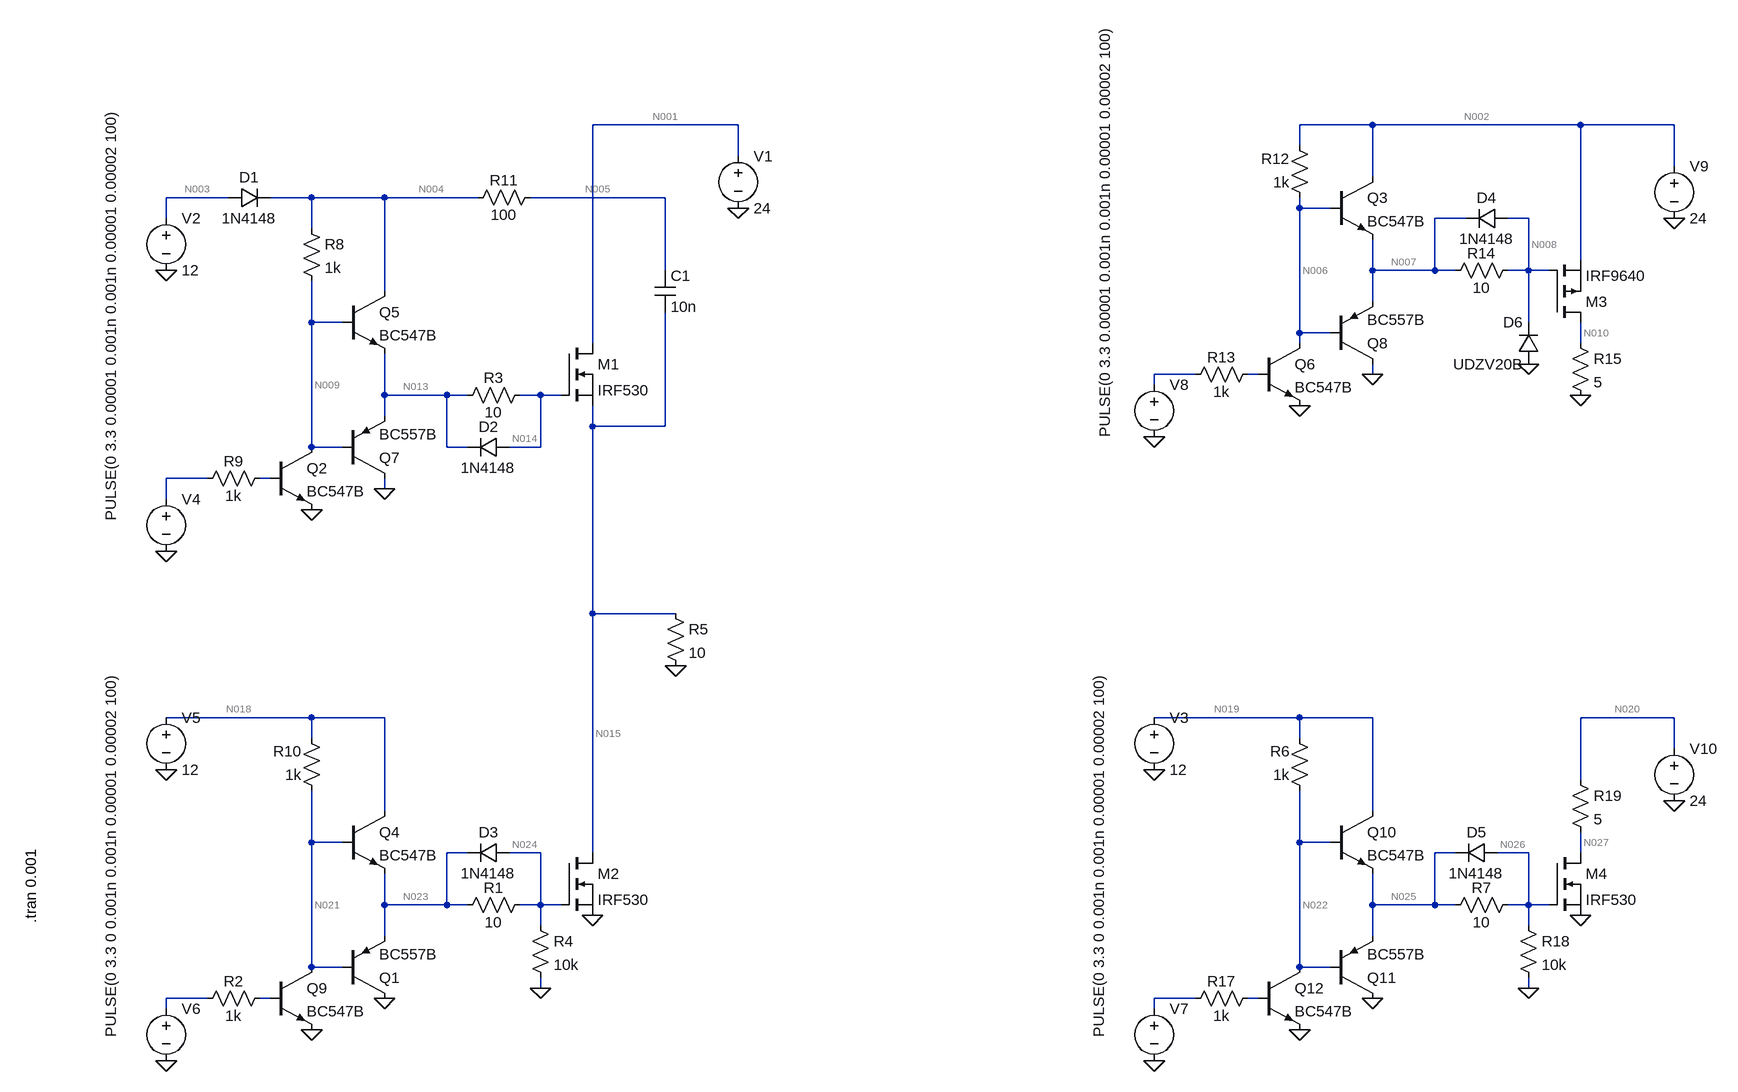
[diagram p0: schematic symulacja.asc]
symulacja.asc, the LTspice schematic file:
Version 4.1
SHEET 1 2692 1396
WIRE 960 -448 736 -448
WIRE 1936 -448 1824 -448
WIRE 2256 -448 1936 -448
WIRE 2400 -448 2256 -448
WIRE 1824 -416 1824 -448
WIRE 960 -400 960 -448
WIRE 2400 -384 2400 -448
WIRE 1936 -368 1936 -448
WIRE 176 -336 80 -336
WIRE 304 -336 240 -336
WIRE 416 -336 304 -336
WIRE 560 -336 416 -336
WIRE 848 -336 640 -336
WIRE 1824 -320 1824 -336
WIRE 1872 -320 1824 -320
WIRE 80 -304 80 -336
WIRE 2080 -304 2032 -304
WIRE 2176 -304 2144 -304
WIRE 304 -288 304 -336
WIRE 2256 -240 2256 -448
WIRE 848 -224 848 -336
WIRE 1936 -224 1936 -272
WIRE 2032 -224 2032 -304
WIRE 2032 -224 1936 -224
WIRE 2064 -224 2032 -224
WIRE 2176 -224 2176 -304
WIRE 2176 -224 2144 -224
WIRE 2208 -224 2176 -224
WIRE 416 -192 416 -336
WIRE 1936 -176 1936 -224
WIRE 304 -144 304 -208
WIRE 352 -144 304 -144
WIRE 2176 -144 2176 -224
WIRE 1824 -128 1824 -320
WIRE 1872 -128 1824 -128
WIRE 736 -112 736 -448
WIRE 1824 -112 1824 -128
WIRE 2256 -112 2256 -144
WIRE 1664 -64 1600 -64
WIRE 1760 -64 1744 -64
WIRE 1936 -64 1936 -80
WIRE 1600 -48 1600 -64
WIRE 416 -32 416 -96
WIRE 512 -32 416 -32
WIRE 544 -32 512 -32
WIRE 656 -32 624 -32
WIRE 688 -32 656 -32
WIRE 416 0 416 -32
WIRE 736 16 736 -16
WIRE 848 16 848 -160
WIRE 848 16 736 16
WIRE 304 48 304 -144
WIRE 352 48 304 48
WIRE 512 48 512 -32
WIRE 544 48 512 48
WIRE 656 48 656 -32
WIRE 656 48 608 48
WIRE 144 96 80 96
WIRE 240 96 224 96
WIRE 416 112 416 96
WIRE 80 128 80 96
WIRE 736 304 736 16
WIRE 864 304 736 304
WIRE 304 464 80 464
WIRE 416 464 304 464
WIRE 1824 464 1600 464
WIRE 1936 464 1824 464
WIRE 2400 464 2256 464
WIRE 304 496 304 464
WIRE 1824 496 1824 464
WIRE 2400 512 2400 464
WIRE 2256 560 2256 464
WIRE 416 608 416 464
WIRE 1936 608 1936 464
WIRE 304 656 304 576
WIRE 352 656 304 656
WIRE 1824 656 1824 576
WIRE 1872 656 1824 656
WIRE 544 672 512 672
WIRE 656 672 608 672
WIRE 736 672 736 304
WIRE 2064 672 2032 672
WIRE 2176 672 2128 672
WIRE 2256 672 2256 640
WIRE 416 752 416 704
WIRE 512 752 512 672
WIRE 512 752 416 752
WIRE 544 752 512 752
WIRE 656 752 656 672
WIRE 656 752 624 752
WIRE 688 752 656 752
WIRE 1936 752 1936 704
WIRE 2032 752 2032 672
WIRE 2032 752 1936 752
WIRE 2064 752 2032 752
WIRE 2176 752 2176 672
WIRE 2176 752 2144 752
WIRE 2208 752 2176 752
WIRE 656 784 656 752
WIRE 2176 784 2176 752
WIRE 416 800 416 752
WIRE 1936 800 1936 752
WIRE 304 848 304 656
WIRE 352 848 304 848
WIRE 1824 848 1824 656
WIRE 1872 848 1824 848
WIRE 656 880 656 864
WIRE 2176 880 2176 864
WIRE 144 896 80 896
WIRE 240 896 224 896
WIRE 1664 896 1600 896
WIRE 1760 896 1744 896
WIRE 80 912 80 896
WIRE 1600 912 1600 896
FLAG 736 768 0
FLAG 80 544 0
FLAG 80 992 0
FLAG 416 896 0
FLAG 304 944 0
FLAG 656 880 0
FLAG 960 -320 0
FLAG 80 208 0
FLAG 80 -224 0
FLAG 304 144 0
FLAG 416 112 0
FLAG 1600 32 0
FLAG 1936 -64 0
FLAG 1824 -16 0
FLAG 2400 -304 0
FLAG 864 384 0
FLAG 2256 768 0
FLAG 1600 544 0
FLAG 1600 992 0
FLAG 1936 896 0
FLAG 1824 944 0
FLAG 2176 880 0
FLAG 2256 -32 0
FLAG 2400 592 0
FLAG 2176 -80 0
SYMBOL npn 352 608 R0
SYMATTR InstName Q4
SYMATTR Value BC547B
SYMBOL nmos 688 672 R0
SYMATTR InstName M2
SYMATTR Value IRF530
SYMBOL res 320 592 R180
WINDOW 0 31 76 Left 2
WINDOW 3 31 40 Left 2
SYMATTR InstName R10
SYMATTR Value 1k
SYMBOL voltage 80 448 R0
WINDOW 123 0 0 Left 0
WINDOW 39 0 0 Left 0
SYMATTR InstName V5
SYMATTR Value 12
SYMBOL voltage 80 896 R0
WINDOW 3 -85 -507 VRight 2
WINDOW 123 0 0 Left 0
WINDOW 39 0 0 Left 0
SYMATTR Value PULSE(0 3.3 0 0.001n 0.001n 0.00001 0.00002 100)
SYMATTR InstName V6
SYMBOL pnp 352 896 M180
SYMATTR InstName Q1
SYMATTR Value BC557B
SYMBOL res 640 736 R90
WINDOW 0 5 56 VBottom 2
WINDOW 3 27 56 VTop 2
SYMATTR InstName R1
SYMATTR Value 10
SYMBOL res 240 880 R90
WINDOW 0 5 56 VBottom 2
WINDOW 3 27 56 VTop 2
SYMATTR InstName R2
SYMATTR Value 1k
SYMBOL res 640 768 R0
SYMATTR InstName R4
SYMATTR Value 10k
SYMBOL voltage 960 -416 R0
WINDOW 123 0 0 Left 0
WINDOW 39 0 0 Left 0
SYMATTR InstName V1
SYMATTR Value 24
SYMBOL voltage 80 112 R0
WINDOW 3 -85 -592 VRight 2
WINDOW 123 0 0 Left 0
WINDOW 39 0 0 Left 0
SYMATTR Value PULSE(0 3.3 0.00001 0.001n 0.001n 0.00001 0.00002 100)
SYMATTR InstName V4
SYMBOL nmos 688 -112 R0
SYMATTR InstName M1
SYMATTR Value IRF530
SYMBOL res 640 -48 R90
WINDOW 0 5 56 VBottom 2
WINDOW 3 27 56 VTop 2
SYMATTR InstName R3
SYMATTR Value 10
SYMBOL voltage 80 -320 R0
WINDOW 123 0 0 Left 0
WINDOW 39 0 0 Left 0
SYMATTR InstName V2
SYMATTR Value 12
SYMBOL diode 176 -320 R270
WINDOW 0 32 32 VTop 2
WINDOW 3 0 32 VBottom 2
SYMATTR InstName D1
SYMATTR Value 1N4148
SYMBOL res 288 -304 R0
SYMATTR InstName R8
SYMATTR Value 1k
SYMBOL cap 832 -224 R0
SYMATTR InstName C1
SYMATTR Value 10n
SYMBOL res 240 80 R90
WINDOW 0 5 56 VBottom 2
WINDOW 3 27 56 VTop 2
SYMATTR InstName R9
SYMATTR Value 1k
SYMBOL res 656 -352 R90
WINDOW 0 5 56 VBottom 2
WINDOW 3 27 56 VTop 2
SYMATTR InstName R11
SYMATTR Value 100
SYMBOL pmos 2208 -144 M180
SYMATTR InstName M3
SYMATTR Value IRF9640
SYMBOL res 1840 -320 R180
WINDOW 0 31 76 Left 2
WINDOW 3 31 40 Left 2
SYMATTR InstName R12
SYMATTR Value 1k
SYMBOL res 1760 -80 R90
WINDOW 0 5 56 VBottom 2
WINDOW 3 27 56 VTop 2
SYMATTR InstName R13
SYMATTR Value 1k
SYMBOL res 2160 -240 R90
WINDOW 0 5 56 VBottom 2
WINDOW 3 27 56 VTop 2
SYMATTR InstName R14
SYMATTR Value 10
SYMBOL voltage 1600 -64 R0
WINDOW 3 -76 -544 VRight 2
WINDOW 123 0 0 Left 0
WINDOW 39 0 0 Left 0
SYMATTR Value PULSE(0 3.3 0.00001 0.001n 0.001n 0.00001 0.00002 100)
SYMATTR InstName V8
SYMBOL voltage 2400 -400 R0
WINDOW 123 0 0 Left 0
WINDOW 39 0 0 Left 0
SYMATTR InstName V9
SYMATTR Value 24
SYMBOL npn 1872 -368 R0
SYMATTR InstName Q3
SYMATTR Value BC547B
SYMBOL npn 352 -192 R0
SYMATTR InstName Q5
SYMATTR Value BC547B
SYMBOL pnp 352 96 M180
SYMATTR InstName Q7
SYMATTR Value BC557B
SYMBOL pnp 1872 -80 M180
SYMATTR InstName Q8
SYMATTR Value BC557B
SYMBOL npn 240 48 R0
SYMATTR InstName Q2
SYMATTR Value BC547B
SYMBOL npn 1760 -112 R0
SYMATTR InstName Q6
SYMATTR Value BC547B
SYMBOL npn 240 848 R0
SYMATTR InstName Q9
SYMATTR Value BC547B
SYMBOL diode 608 32 R90
WINDOW 0 0 32 VBottom 2
WINDOW 3 32 32 VTop 2
SYMATTR InstName D2
SYMATTR Value 1N4148
SYMBOL diode 608 656 R90
WINDOW 0 0 32 VBottom 2
WINDOW 3 32 32 VTop 2
SYMATTR InstName D3
SYMATTR Value 1N4148
SYMBOL diode 2144 -320 R90
WINDOW 0 0 32 VBottom 2
WINDOW 3 32 32 VTop 2
SYMATTR InstName D4
SYMATTR Value 1N4148
SYMBOL res 848 288 R0
SYMATTR InstName R5
SYMATTR Value 10
SYMBOL npn 1872 608 R0
SYMATTR InstName Q10
SYMATTR Value BC547B
SYMBOL nmos 2208 672 R0
SYMATTR InstName M4
SYMATTR Value IRF530
SYMBOL res 1840 592 R180
WINDOW 0 31 76 Left 2
WINDOW 3 31 40 Left 2
SYMATTR InstName R6
SYMATTR Value 1k
SYMBOL voltage 1600 448 R0
WINDOW 123 0 0 Left 0
WINDOW 39 0 0 Left 0
SYMATTR InstName V3
SYMATTR Value 12
SYMBOL voltage 1600 896 R0
WINDOW 3 -85 -507 VRight 2
WINDOW 123 0 0 Left 0
WINDOW 39 0 0 Left 0
SYMATTR Value PULSE(0 3.3 0 0.001n 0.001n 0.00001 0.00002 100)
SYMATTR InstName V7
SYMBOL pnp 1872 896 M180
SYMATTR InstName Q11
SYMATTR Value BC557B
SYMBOL res 2160 736 R90
WINDOW 0 5 56 VBottom 2
WINDOW 3 27 56 VTop 2
SYMATTR InstName R7
SYMATTR Value 10
SYMBOL res 1760 880 R90
WINDOW 0 5 56 VBottom 2
WINDOW 3 27 56 VTop 2
SYMATTR InstName R17
SYMATTR Value 1k
SYMBOL res 2160 768 R0
SYMATTR InstName R18
SYMATTR Value 10k
SYMBOL npn 1760 848 R0
SYMATTR InstName Q12
SYMATTR Value BC547B
SYMBOL diode 2128 656 R90
WINDOW 0 0 32 VBottom 2
WINDOW 3 32 32 VTop 2
SYMATTR InstName D5
SYMATTR Value 1N4148
SYMBOL res 2240 -128 R0
SYMATTR InstName R15
SYMATTR Value 5
SYMBOL res 2240 544 R0
SYMATTR InstName R19
SYMATTR Value 5
SYMBOL voltage 2400 496 R0
WINDOW 123 0 0 Left 0
WINDOW 39 0 0 Left 0
SYMATTR InstName V10
SYMATTR Value 24
SYMBOL diode 2192 -80 R180
WINDOW 0 24 64 Left 2
WINDOW 3 24 0 Left 2
SYMATTR InstName D6
SYMATTR Value UDZV20B
TEXT -128 664 VRight 2 !.tran 0.001

The netlist it stands for:
* symulacja.asc
Q4 N018 N021 N023 0 BC547B
M2 N015 N024 0 0 IRF530
R10 N021 N018 1k
V5 N018 0 12
V6 N028 0 PULSE(0 3.3 0 0.001n 0.001n 0.00001 0.00002 100)
Q1 0 N021 N023 0 BC557B
R1 N024 N023 10
R2 N029 N028 1k
R4 N024 0 10k
V1 N001 0 24
V4 N016 0 PULSE(0 3.3 0.00001 0.001n 0.001n 0.00001 0.00002 100)
M1 N001 N014 N015 N015 IRF530
R3 N014 N013 10
V2 N003 0 12
D1 N003 N004 1N4148
R8 N004 N009 1k
C1 N005 N015 10n
R9 N017 N016 1k
R11 N005 N004 100
M3 N010 N008 N002 N002 IRF9640
R12 N006 N002 1k
R13 N012 N011 1k
R14 N008 N007 10
V8 N011 0 PULSE(0 3.3 0.00001 0.001n 0.001n 0.00001 0.00002 100)
V9 N002 0 24
Q3 N002 N006 N007 0 BC547B
Q5 N004 N009 N013 0 BC547B
Q7 0 N009 N013 0 BC557B
Q8 0 N006 N007 0 BC557B
Q2 N009 N017 0 0 BC547B
Q6 N006 N012 0 0 BC547B
Q9 N021 N029 0 0 BC547B
D2 N014 N013 1N4148
D3 N024 N023 1N4148
D4 N008 N007 1N4148
R5 N015 0 10
Q10 N019 N022 N025 0 BC547B
M4 N027 N026 0 0 IRF530
R6 N022 N019 1k
V3 N019 0 12
V7 N030 0 PULSE(0 3.3 0 0.001n 0.001n 0.00001 0.00002 100)
Q11 0 N022 N025 0 BC557B
R7 N026 N025 10
R17 N031 N030 1k
R18 N026 0 10k
Q12 N022 N031 0 0 BC547B
D5 N026 N025 1N4148
R15 N010 0 5
R19 N020 N027 5
V10 N020 0 24
D6 0 N008 UDZV20B
.model D D
.lib standard.dio
.model NPN NPN
.model PNP PNP
.lib standard.bjt
.model NMOS NMOS
.model PMOS PMOS
.lib standard.mos
.tran 0.001
.backanno
.end

* Results of the author's LTspice run, read from the files saved beside the schematic
* Operating Point, zero values left out:
*   V(n001) = 24 V
*   V(n002) = 24 V
*   V(n003) = 12 V
*   V(n004) = 12 V
*   V(n005) = 12 V
*   V(n006) = 22.71 V
*   V(n007) = 21.83 V
*   V(n008) = 20.15 V
*   V(n009) = 12 V
*   V(n010) = 2.11 V
*   V(n013) = 11.99 V
*   V(n014) = 11.99 V
*   V(n015) = 3.781 V
*   V(n018) = 12 V
*   V(n019) = 12 V
*   V(n020) = 24 V
*   V(n021) = 12 V
*   V(n022) = 12 V
*   V(n023) = 11.35 V
*   V(n024) = 11.34 V
*   V(n025) = 11.35 V
*   V(n026) = 11.34 V
*   V(n027) = 422.8 mV
*   I(D1) = 24.42 pA
*   I(D3) = -558 pA
*   I(D4) = -2.522 nA
*   I(D5) = -558 pA
*   I(D6) = -168.5 mA
*   I(R1) = -1.134 mA
*   I(R10) = -4.006 µA
*   I(R12) = -1.294 mA
*   I(R13) = 22.77 pA
*   I(R14) = -168.5 mA
*   I(R15) = 422.1 mA
*   I(R17) = 12.06 pA
*   I(R18) = 1.134 mA
*   I(R19) = 4.715 A
*   I(R2) = 12.06 pA
*   I(R4) = 1.134 mA
*   I(R5) = 378.1 mA
*   I(R6) = -4.006 µA
*   I(R7) = -1.134 mA
*   I(R8) = 24.41 pA
*   I(R9) = 12.07 pA
*   I(V1) = -40.7 A
*   I(V10) = -4.715 A
*   I(V2) = -24.42 pA
*   I(V3) = -1.134 mA
*   I(V4) = 12.07 pA
*   I(V5) = -1.134 mA
*   I(V6) = 12.06 pA
*   I(V7) = 12.06 pA
*   I(V8) = 22.77 pA
*   I(V9) = -590.6 mA
*   Ib(Q1) = 12.94 pA
*   Ib(Q10) = 4.006 µA
*   Ib(Q11) = 12.94 pA
*   Ib(Q12) = -12.06 pA
*   Ib(Q2) = -12.07 pA
*   Ib(Q3) = 1.294 mA
*   Ib(Q4) = 4.006 µA
*   Ib(Q6) = -22.77 pA
*   Ib(Q7) = 12.3 pA
*   Ib(Q8) = 23.88 pA
*   Ib(Q9) = -12.06 pA
*   Ic(Q1) = -12.28 pA
*   Ic(Q10) = 1.13 mA
*   Ic(Q11) = -12.28 pA
*   Ic(Q12) = 12.09 pA
*   Ic(Q2) = 12.09 pA
*   Ic(Q3) = 167.2 mA
*   Ic(Q4) = 1.13 mA
*   Ic(Q6) = 22.8 pA
*   Ic(Q7) = -12.33 pA
*   Ic(Q8) = -22.99 pA
*   Ic(Q9) = 12.09 pA
*   Id(M1) = 40.7 A
*   Id(M2) = 40.32 A
*   Id(M3) = -422.1 mA
*   Id(M4) = 4.715 A
*   Ie(Q10) = -1.134 mA
*   Ie(Q3) = -168.5 mA
*   Ie(Q4) = -1.134 mA
*   Is(M1) = -40.7 A
*   Is(M2) = -40.32 A
*   Is(M3) = 422.1 mA
*   Is(M4) = -4.715 A